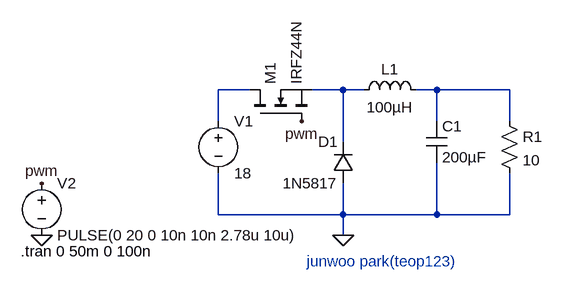
[diagram p0: schematic buck_converter.asc]
buck_converter.asc, the LTspice schematic file:
Version 4.1
SHEET 1 880 824
WIRE 96 96 48 96
WIRE 240 96 192 96
WIRE 272 96 240 96
WIRE 384 96 352 96
WIRE 496 96 384 96
WIRE 48 144 48 96
WIRE 384 144 384 96
WIRE 496 144 496 96
WIRE 240 176 240 96
WIRE 48 288 48 224
WIRE 240 288 240 240
WIRE 240 288 48 288
WIRE 384 288 384 208
WIRE 384 288 240 288
WIRE 496 288 496 224
WIRE 496 288 384 288
WIRE 240 320 240 288
FLAG -224 320 0
FLAG -224 240 pwm
FLAG 176 144 pwm
FLAG 240 320 0
SYMBOL voltage 48 128 R0
WINDOW 123 0 0 Left 0
WINDOW 39 0 0 Left 0
SYMATTR InstName V1
SYMATTR Value 18
SYMBOL cap 368 144 R0
SYMATTR InstName C1
SYMATTR Value 200µF
SYMBOL ind 256 112 R270
WINDOW 0 32 56 VTop 2
WINDOW 3 5 56 VBottom 2
SYMATTR InstName L1
SYMATTR Value 100µH
SYMATTR SpiceLine Rser=1m
SYMBOL res 480 128 R0
SYMATTR InstName R1
SYMATTR Value 10
SYMBOL nmos 96 144 R270
SYMATTR InstName M1
SYMATTR Value IRFZ44N
SYMBOL voltage -224 224 R0
WINDOW 123 0 0 Left 0
WINDOW 39 0 0 Left 0
SYMATTR InstName V2
SYMATTR Value PULSE(0 20 0 10n 10n 2.78u 10u)
SYMBOL diode 256 240 R180
WINDOW 0 24 64 Left 2
WINDOW 3 24 0 Left 2
SYMATTR InstName D1
SYMATTR Value 1N5817
SYMATTR Description Diode
SYMATTR Type diode
TEXT -256 344 Left 2 !.tran 0 50m 0 100n
TEXT 184 360 Left 2 ;junwoo park(teop123)

The netlist it stands for:
* buck_converter.asc
V1 N001 0 18
C1 N003 0 200µF
L1 N002 N003 100µH Rser=1m
R1 N003 0 10
M1 N001 pwm N002 N002 IRFZ44N
V2 pwm 0 PULSE(0 20 0 10n 10n 2.78u 10u)
D1 0 N002 1N5817
.model D D
.lib standard.dio
.model NMOS NMOS
.model PMOS PMOS
.lib standard.mos
.tran 0 50m 0 100n
* junwoo park(teop123)
.backanno
.end